# EAGLE design T3DPC_v0.5 (EAGLE 8.5.1)

## Sheet 1 of 4
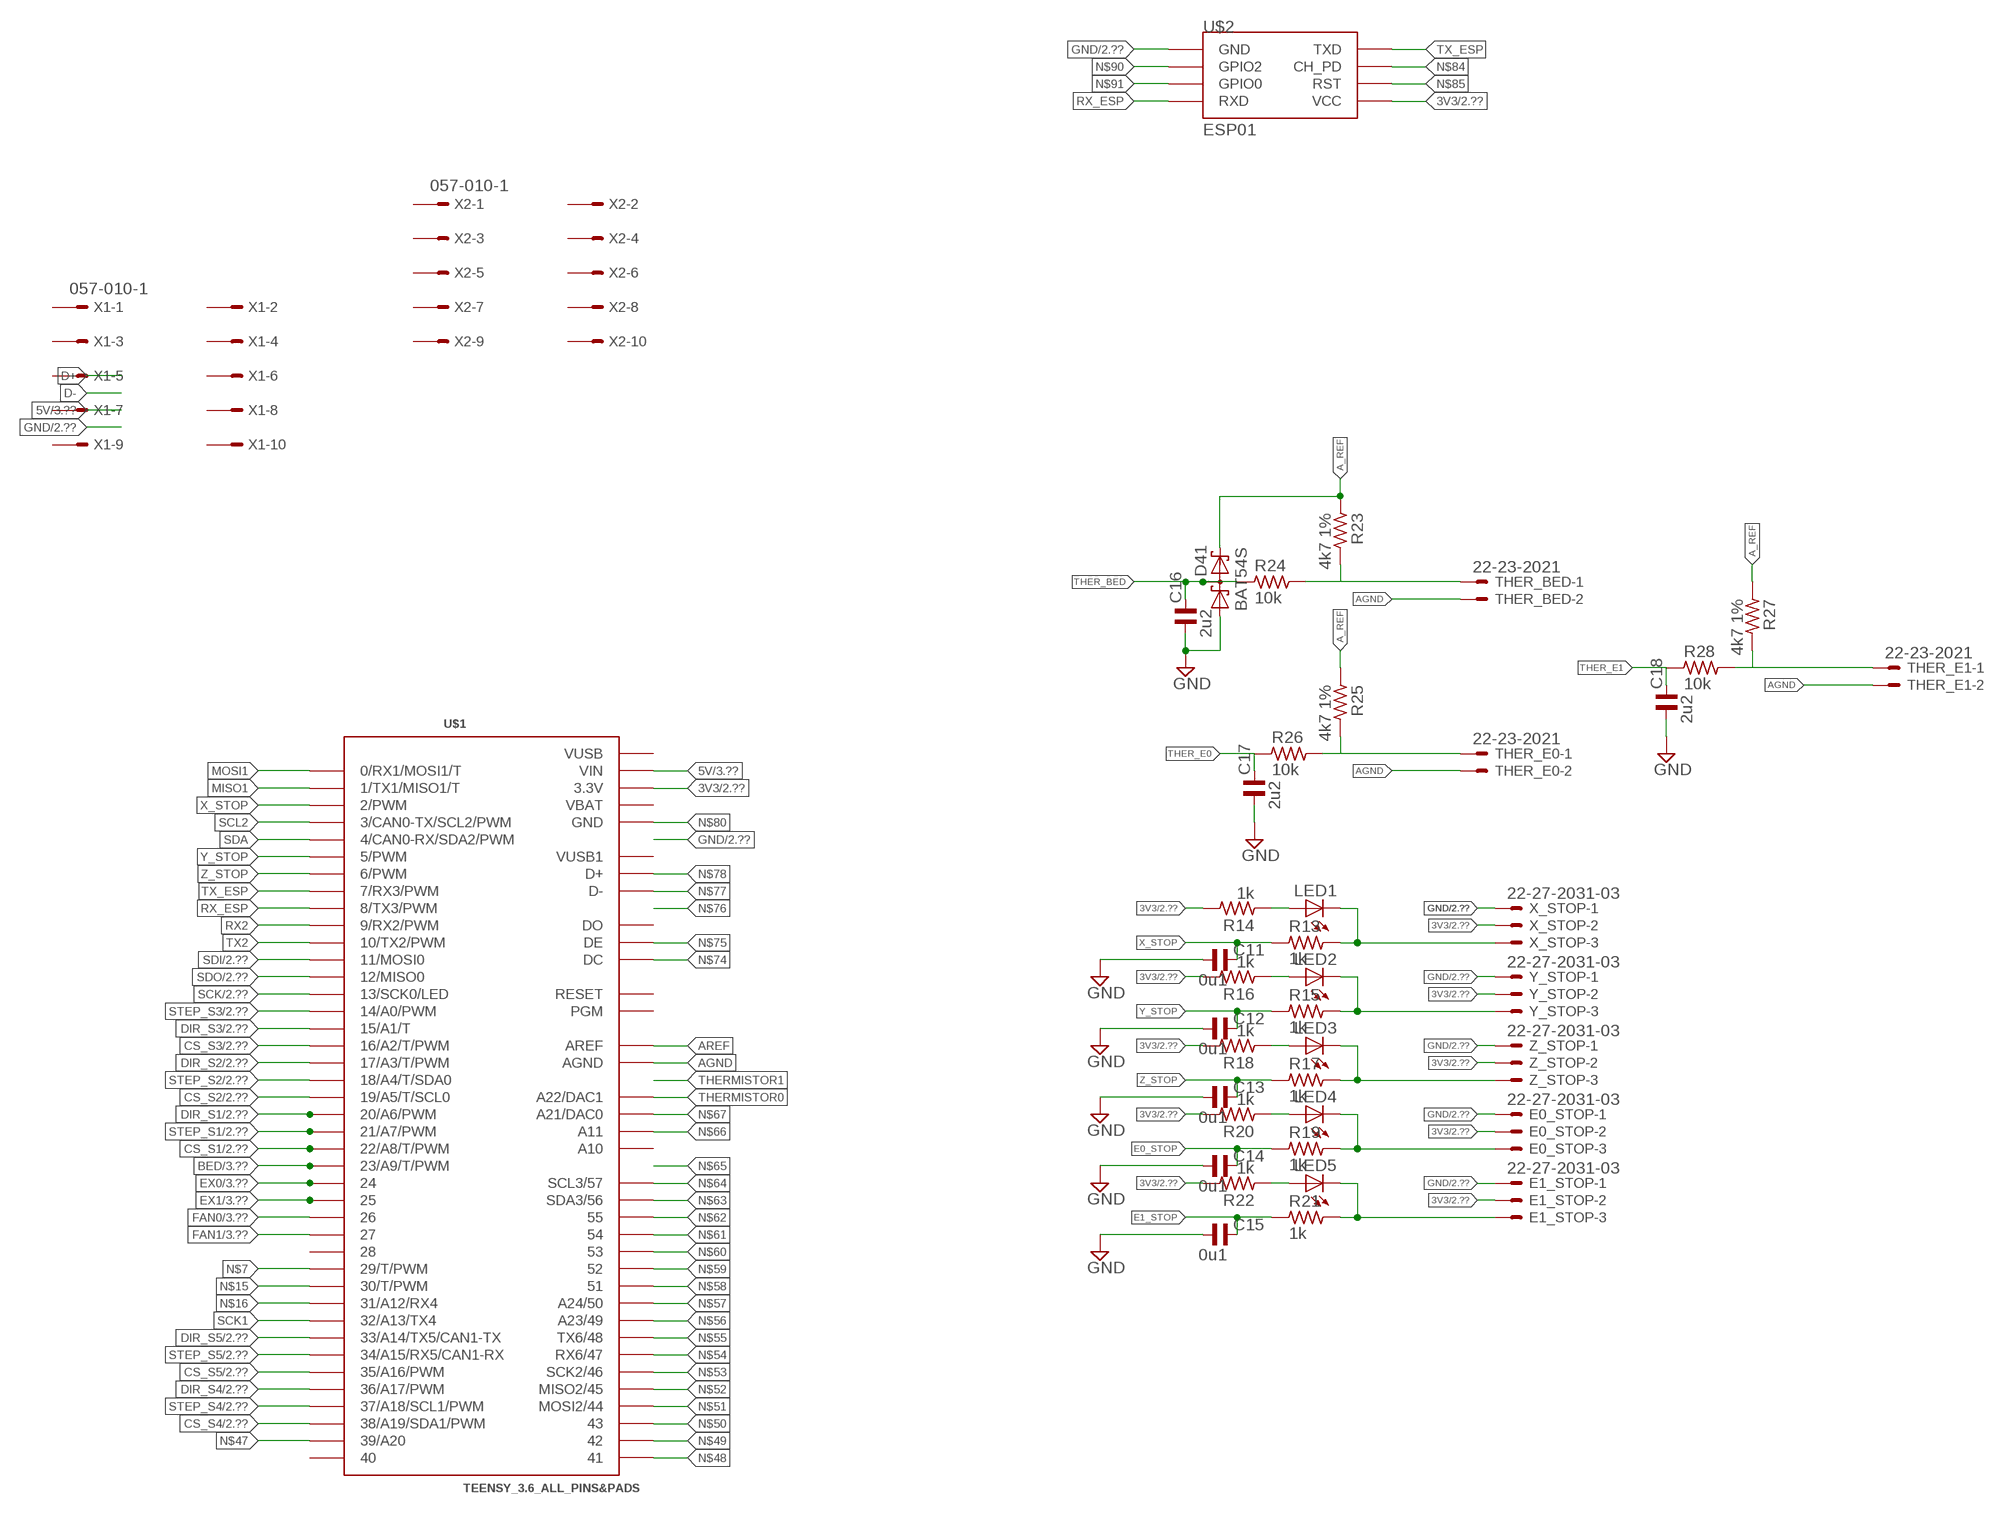
[diagram p0: schematic, sheet 1]

### Parts
C11  0u1  C_0805  [C0805]
C12  0u1  C_0805  [C0805]
C13  0u1  C_0805  [C0805]
C14  0u1  C_0805  [C0805]
C15  0u1  C_0805  [C0805]
C16  2u2  C_0805  [C0805]
C17  2u2  C_0805  [C0805]
C18  2u2  C_0805  [C0805]
D41  BAT54S  [SOT23]
E0_STOP  22-27-2031-03  [6410-03]
E1_STOP  22-27-2031-03  [6410-03]
LED1  LEDCHIPLED_1206  [CHIPLED_1206]
LED2  LEDCHIPLED_1206  [CHIPLED_1206]
LED3  LEDCHIPLED_1206  [CHIPLED_1206]
LED4  LEDCHIPLED_1206  [CHIPLED_1206]
LED5  LEDCHIPLED_1206  [CHIPLED_1206]
R13  1k  R_0805  [R0805]
R14  1k  R_0805  [R0805]
R15  1k  R_0805  [R0805]
R16  1k  R_0805  [R0805]
R17  1k  R_0805  [R0805]
R18  1k  R_0805  [R0805]
R19  1k  R_0805  [R0805]
R20  1k  R_0805  [R0805]
R21  1k  R_0805  [R0805]
R22  1k  R_0805  [R0805]
R23  4k7 1%  R_0805  [R0805]
R24  10k  R_0805  [R0805]
R25  4k7 1%  R_0805  [R0805]
R26  10k  R_0805  [R0805]
R27  4k7 1%  R_0805  [R0805]
R28  10k  R_0805  [R0805]
THER_BED  22-23-2021  [22-23-2021]
THER_E0  22-23-2021  [22-23-2021]
THER_E1  22-23-2021  [22-23-2021]
U$1  TEENSY_3.6_ALL_PINS&PADS  [TEENSY_3.6_ALL_PINS&PADS]
U$2  ESP01  [ESP01]
X1  057-010-1  [057-010-1]
X2  057-010-1  [057-010-1]
X_STOP  22-27-2031-03  [6410-03]
Y_STOP  22-27-2031-03  [6410-03]
Z_STOP  22-27-2031-03  [6410-03]

### Nets
3V3: E0_STOP.2 E1_STOP.2 R14.2 R16.2 R18.2 R20.2 R22.2 U$1.3.3V U$1.3.3V2(3.3V) U$1.3.3V3(3.3V) U$1.3.3V4(3.3V) U$2.VCC X_STOP.2 Y_STOP.2 Z_STOP.2 ; also sheet 2,3
5V: U$1.VIN ; also sheet 3,4
A_REF: D41.2(C2) R23.1 R25.1 R27.1
AGND: C16.1 C17.1 C18.1 D41.1(A1) THER_BED.2 THER_E0.2 THER_E1.2 U$1.AGND ; supply symbol labelled GND
AREF: U$1.AREF
BED: U$1.23/A9(23/A9/T/PWM) ; also sheet 3
CS_S1: U$1.22/A8(22/A8/T/PWM) ; also sheet 2
CS_S2: U$1.19/A5(19/A5/T/SCL0) ; also sheet 2
CS_S3: U$1.16/A2(16/A2/T/PWM) ; also sheet 2
CS_S4: U$1.38/A19(38/A19/SDA1/PWM) ; also sheet 2
CS_S5: U$1.35/A16(35/A16/PWM) ; also sheet 2
DIR_S1: U$1.20/A6(20/A6/PWM) ; also sheet 2
DIR_S2: U$1.17/A3(17/A3/T/PWM) ; also sheet 2
DIR_S3: U$1.15/A1(15/A1/T) ; also sheet 2
DIR_S4: U$1.36/A17(36/A17/PWM) ; also sheet 2
DIR_S5: U$1.33/A14(33/A14/TX5/CAN1-TX) ; also sheet 2
E0_STOP: C14.2 R19.1
E0_STOP_PORT: E0_STOP.3 LED4.C R19.2
E1_STOP: C15.2 R21.1
E1_STOP_PORT: E1_STOP.3 LED5.C R21.2
EX0: U$1.24 ; also sheet 3
EX1: U$1.25 ; also sheet 3
GND: C11.1 C12.1 C13.1 C14.1 C15.1 E0_STOP.1 E1_STOP.1 U$2.GND X_STOP.1 Y_STOP.1 Z_STOP.1 ; also sheet 2,3,4
MISO1: U$1.1(1/TX1/MISO1/T)
MOSI1: U$1.0(0/RX1/MOSI1/T)
N$7: U$1.29(29/T/PWM)
N$10: LED1.A R14.1
N$13: LED2.A R16.1
N$14: LED3.A R18.1
N$15: U$1.30(30/T/PWM)
N$16: U$1.31/A12(31/A12/RX4)
N$17: LED4.A R20.1
N$18: LED5.A R22.1
N$19: R25.2 R26.2 THER_E0.1
N$20: R23.2 R24.2 THER_BED.1
N$22: R27.2 R28.2 THER_E1.1
N$47: U$1.39/A20
N$48: U$1.41
N$49: U$1.42
N$50: U$1.43
N$51: U$1.44(MOSI2/44)
N$52: U$1.45(MISO2/45)
N$53: U$1.46(SCK2/46)
N$54: U$1.47(RX6/47)
N$55: U$1.48(TX6/48)
N$56: U$1.49(A23/49)
N$57: U$1.50(A24/50)
N$58: U$1.51
N$59: U$1.52
N$60: U$1.53
N$61: U$1.54
N$62: U$1.55
N$63: U$1.56(SDA3/56)
N$64: U$1.57(SCL3/57)
N$66: U$1.A11
N$67: U$1.A21(A21/DAC0)
N$74: U$1.DC
N$75: U$1.DE
N$77: U$1.D-
N$78: U$1.D+
N$80: U$1.GND U$1.GND1(GND) U$1.GND2(GND) U$1.GND3(GND) U$1.GND4(GND) U$1.GND5(GND) U$1.GND6(GND)
N$84: U$2.CH_PD
N$85: U$2.RST
N$90: U$2.GPIO2
N$91: U$2.GPIO0
RX2: U$1.9(9/RX2/PWM)
RX_ESP: U$1.8(8/TX3/PWM) U$2.RX(RXD)
SCK: U$1.13(13/SCK0/LED) ; also sheet 2
SCK1: U$1.32/A13(32/A13/TX4)
SCL2: U$1.3(3/CAN0-TX/SCL2/PWM)
SDA: U$1.4(4/CAN0-RX/SDA2/PWM)
SDI: U$1.11(11/MOSI0) ; also sheet 2
SDO: U$1.12(12/MISO0) ; also sheet 2
STEP_S1: U$1.21/A7(21/A7/PWM) ; also sheet 2
STEP_S2: U$1.18/A4(18/A4/T/SDA0) ; also sheet 2
STEP_S3: U$1.14/A0(14/A0/PWM) ; also sheet 2
STEP_S4: U$1.37/A18(37/A18/SCL1/PWM) ; also sheet 2
STEP_S5: U$1.34/A15(34/A15/RX5/CAN1-RX) ; also sheet 2
THER_BED: C16.2 D41.3(C1A2) R24.1
THER_E0: C17.2 R26.1
THER_E1: C18.2 R28.1
THERMISTOR0: U$1.A22(A22/DAC1)
TX2: U$1.10(10/TX2/PWM)
TX_ESP: U$1.7(7/RX3/PWM) U$2.TX(TXD)
X_STOP: C11.2 R13.1 U$1.2(2/PWM)
X_STOP_PORT: LED1.C R13.2 X_STOP.3
Y_STOP: C12.2 R15.1 U$1.5(5/PWM)
Y_STOP_PORT: LED2.C R15.2 Y_STOP.3
Z_STOP: C13.2 R17.1 U$1.6(6/PWM)
Z_STOP_PORT: LED3.C R17.2 Z_STOP.3
Unconnected: U$1.26 U$1.27 U$1.28 U$1.40 U$1.A10 U$1.DO U$1.PGM U$1.RESET X1.1 X1.2 X1.3 X1.4 X1.5 X1.6 X1.7 X1.8 X1.9 X1.10 X2.1 X2.2 X2.3 X2.4 X2.5 X2.6 X2.7 X2.8 X2.9 X2.10

## Sheet 2 of 4
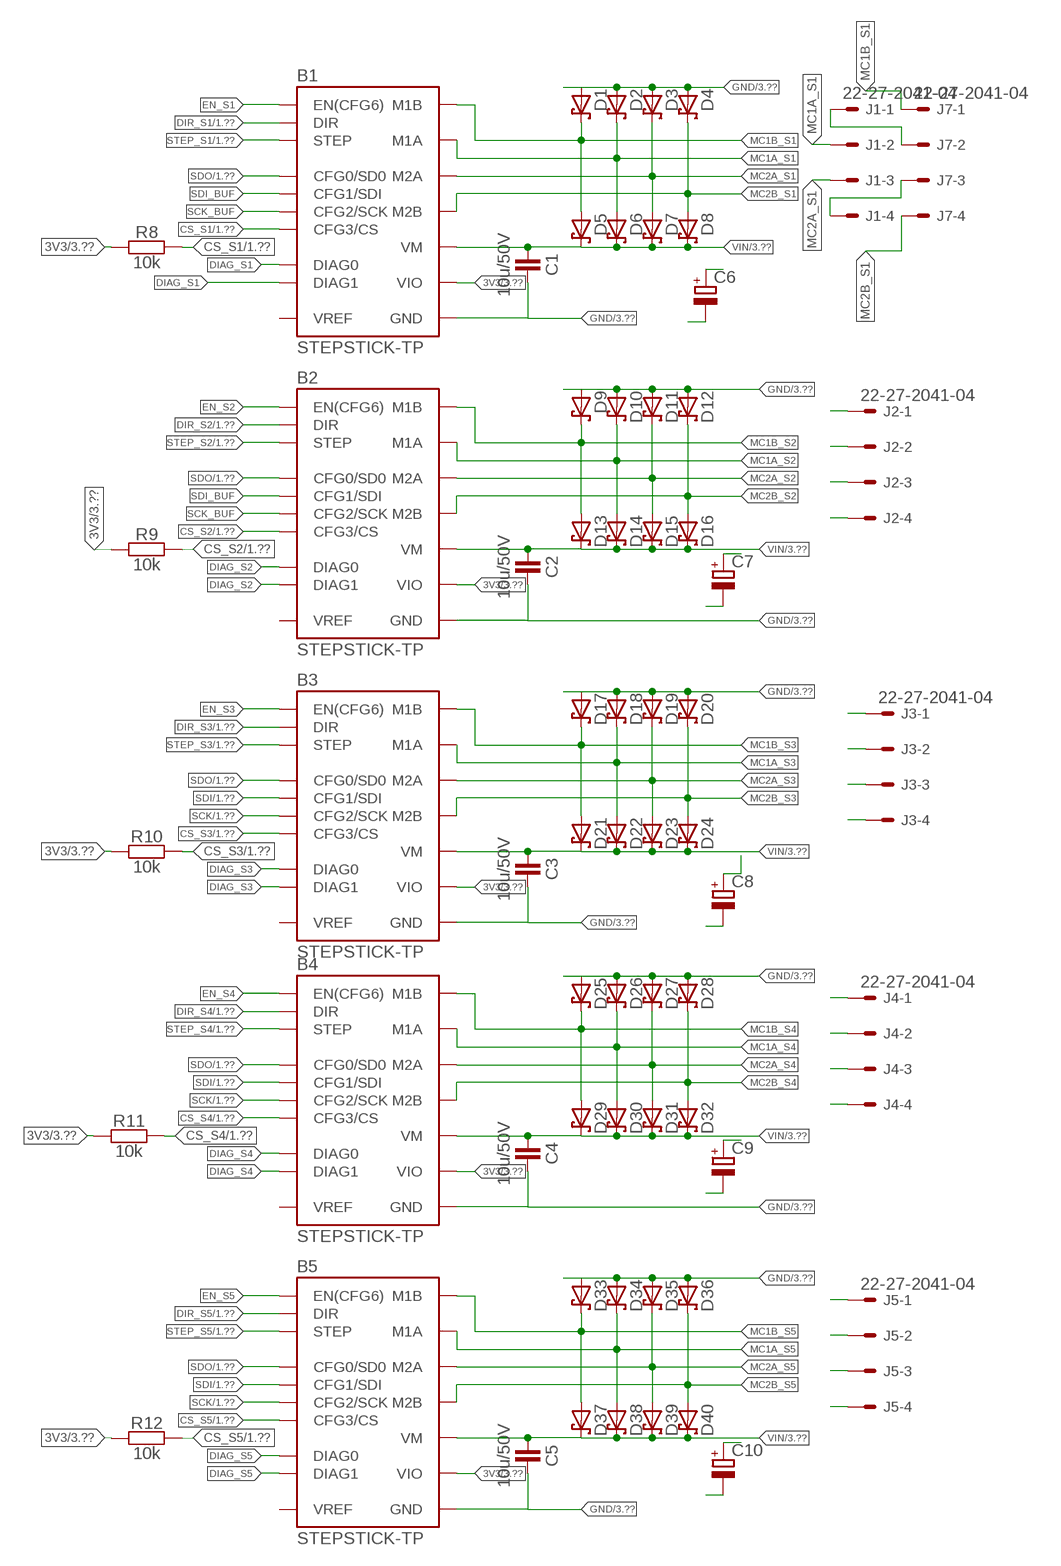
[diagram p1: schematic, sheet 2]

### Parts
B1  STEPSTICK-TP  [STEPSTICK_TP]
B2  STEPSTICK-TP  [STEPSTICK_TP]
B3  STEPSTICK-TP  [STEPSTICK_TP]
B4  STEPSTICK-TP  [STEPSTICK_TP]
B5  STEPSTICK-TP  [STEPSTICK_TP]
C1  10u/50V  CAPACITOR-1210  [C1210]
C2  10u/50V  CAPACITOR-1210  [C1210]
C3  10u/50V  CAPACITOR-1210  [C1210]
C4  10u/50V  CAPACITOR-1210  [C1210]
C5  10u/50V  CAPACITOR-1210  [C1210]
C6  CPOL-EU153CLV-0505  [153CLV-0505]
C7  CPOL-EU153CLV-0505  [153CLV-0505]
C8  CPOL-EU153CLV-0505  [153CLV-0505]
C9  CPOL-EU153CLV-0505  [153CLV-0505]
C10  CPOL-EU153CLV-0505  [153CLV-0505]
D1  D_SCHOTTKY-SMA  [SMA_DO214AC]
D2  D_SCHOTTKY-SMA  [SMA_DO214AC]
D3  D_SCHOTTKY-SMA  [SMA_DO214AC]
D4  D_SCHOTTKY-SMA  [SMA_DO214AC]
D5  D_SCHOTTKY-SMA  [SMA_DO214AC]
D6  D_SCHOTTKY-SMA  [SMA_DO214AC]
D7  D_SCHOTTKY-SMA  [SMA_DO214AC]
D8  D_SCHOTTKY-SMA  [SMA_DO214AC]
D9  D_SCHOTTKY-SMA  [SMA_DO214AC]
D10  D_SCHOTTKY-SMA  [SMA_DO214AC]
D11  D_SCHOTTKY-SMA  [SMA_DO214AC]
D12  D_SCHOTTKY-SMA  [SMA_DO214AC]
D13  D_SCHOTTKY-SMA  [SMA_DO214AC]
D14  D_SCHOTTKY-SMA  [SMA_DO214AC]
D15  D_SCHOTTKY-SMA  [SMA_DO214AC]
D16  D_SCHOTTKY-SMA  [SMA_DO214AC]
D17  D_SCHOTTKY-SMA  [SMA_DO214AC]
D18  D_SCHOTTKY-SMA  [SMA_DO214AC]
D19  D_SCHOTTKY-SMA  [SMA_DO214AC]
D20  D_SCHOTTKY-SMA  [SMA_DO214AC]
D21  D_SCHOTTKY-SMA  [SMA_DO214AC]
D22  D_SCHOTTKY-SMA  [SMA_DO214AC]
D23  D_SCHOTTKY-SMA  [SMA_DO214AC]
D24  D_SCHOTTKY-SMA  [SMA_DO214AC]
D25  D_SCHOTTKY-SMA  [SMA_DO214AC]
D26  D_SCHOTTKY-SMA  [SMA_DO214AC]
D27  D_SCHOTTKY-SMA  [SMA_DO214AC]
D28  D_SCHOTTKY-SMA  [SMA_DO214AC]
D29  D_SCHOTTKY-SMA  [SMA_DO214AC]
D30  D_SCHOTTKY-SMA  [SMA_DO214AC]
D31  D_SCHOTTKY-SMA  [SMA_DO214AC]
D32  D_SCHOTTKY-SMA  [SMA_DO214AC]
D33  D_SCHOTTKY-SMA  [SMA_DO214AC]
D34  D_SCHOTTKY-SMA  [SMA_DO214AC]
D35  D_SCHOTTKY-SMA  [SMA_DO214AC]
D36  D_SCHOTTKY-SMA  [SMA_DO214AC]
D37  D_SCHOTTKY-SMA  [SMA_DO214AC]
D38  D_SCHOTTKY-SMA  [SMA_DO214AC]
D39  D_SCHOTTKY-SMA  [SMA_DO214AC]
D40  D_SCHOTTKY-SMA  [SMA_DO214AC]
J1  22-27-2041-04  [6410-04]
J2  22-27-2041-04  [6410-04]
J3  22-27-2041-04  [6410-04]
J4  22-27-2041-04  [6410-04]
J5  22-27-2041-04  [6410-04]
J7  22-27-2041-04  [6410-04]
R8  10k  RESISTOR-0805  [C0805]
R9  10k  RESISTOR-0805  [C0805]
R10  10k  RESISTOR-0805  [C0805]
R11  10k  RESISTOR-0805  [C0805]
R12  10k  RESISTOR-0805  [C0805]

### Nets
3V3: B1.VIO B2.VIO B3.VIO B4.VIO B5.VIO R8.1 R9.1 R10.1 R11.1 R12.1 ; also sheet 1,3
CS_S1: B1.CFG3(CFG3/CS) R8.2 ; also sheet 1
CS_S2: B2.CFG3(CFG3/CS) R9.2 ; also sheet 1
CS_S3: B3.CFG3(CFG3/CS) R10.2 ; also sheet 1
CS_S4: B4.CFG3(CFG3/CS) R11.2 ; also sheet 1
CS_S5: B5.CFG3(CFG3/CS) R12.2 ; also sheet 1
DIAG_S1: B1.DIAG0 B1.DIAG1
DIAG_S2: B2.DIAG0 B2.DIAG1
DIAG_S3: B3.DIAG0 B3.DIAG1
DIAG_S4: B4.DIAG0 B4.DIAG1
DIAG_S5: B5.DIAG0 B5.DIAG1
DIR_S1: B1.DIR ; also sheet 1
DIR_S2: B2.DIR ; also sheet 1
DIR_S3: B3.DIR ; also sheet 1
DIR_S4: B4.DIR ; also sheet 1
DIR_S5: B5.DIR ; also sheet 1
EN_S1: B1.EN(EN(CFG6))
EN_S2: B2.EN(EN(CFG6))
EN_S3: B3.EN(EN(CFG6))
EN_S4: B4.EN(EN(CFG6))
EN_S5: B5.EN(EN(CFG6))
GND: B1.GND@1(GND) B1.GND@2(GND) B2.GND@1(GND) B2.GND@2(GND) B3.GND@1(GND) B3.GND@2(GND) B4.GND@1(GND) B4.GND@2(GND) B5.GND@1(GND) B5.GND@2(GND) C1.2 C2.2 C3.2 C4.2 C5.2 C6.- C7.- C8.- C9.- C10.- D1.A D2.A D3.A D4.A D9.A D10.A D11.A D12.A D17.A D18.A D19.A D20.A D25.A D26.A D27.A D28.A D33.A D34.A D35.A D36.A ; also sheet 1,3,4
MC1A_S1: B1.M1A D2.C D6.A J1.2
MC1A_S2: B2.M1A D10.C D14.A J2.2
MC1A_S3: B3.M1A D18.C D22.A J3.2
MC1A_S4: B4.M1A D26.C D30.A J4.2
MC1A_S5: B5.M1A D34.C D38.A J5.2
MC1B_S1: B1.M1B D1.C D5.A J7.1
MC1B_S2: B2.M1B D9.C D13.A J2.1
MC1B_S3: B3.M1B D17.C D21.A J3.1
MC1B_S4: B4.M1B D25.C D29.A J4.1
MC1B_S5: B5.M1B D33.C D37.A J5.1
MC2A_S1: B1.M2A D3.C D7.A J1.3
MC2A_S2: B2.M2A D11.C D15.A J2.3
MC2A_S3: B3.M2A D19.C D23.A J3.3
MC2A_S4: B4.M2A D27.C D31.A J4.3
MC2A_S5: B5.M2A D35.C D39.A J5.3
MC2B_S1: B1.M2B D4.C D8.A J7.4
MC2B_S2: B2.M2B D12.C D16.A J2.4
MC2B_S3: B3.M2B D20.C D24.A J3.4
MC2B_S4: B4.M2B D28.C D32.A J4.4
MC2B_S5: B5.M2B D36.C D40.A J5.4
N$11: J1.4 J7.3
N$12: J1.1 J7.2
SCK: B3.CFG2(CFG2/SCK) B4.CFG2(CFG2/SCK) B5.CFG2(CFG2/SCK) ; also sheet 1
SCK_BUF: B1.CFG2(CFG2/SCK) B2.CFG2(CFG2/SCK)
SDI: B3.CFG1(CFG1/SDI) B4.CFG1(CFG1/SDI) B5.CFG1(CFG1/SDI) ; also sheet 1
SDI_BUF: B1.CFG1(CFG1/SDI) B2.CFG1(CFG1/SDI)
SDO: B1.NC/CFG0(CFG0/SD0) B2.NC/CFG0(CFG0/SD0) B3.NC/CFG0(CFG0/SD0) B4.NC/CFG0(CFG0/SD0) B5.NC/CFG0(CFG0/SD0) ; also sheet 1
STEP_S1: B1.STEP ; also sheet 1
STEP_S2: B2.STEP ; also sheet 1
STEP_S3: B3.STEP ; also sheet 1
STEP_S4: B4.STEP ; also sheet 1
STEP_S5: B5.STEP ; also sheet 1
VIN: B1.VM B2.VM B3.VM B4.VM B5.VM C1.1 C2.1 C3.1 C4.1 C5.1 C6.+ C7.+ C8.+ C9.+ C10.+ D5.C D6.C D7.C D8.C D13.C D14.C D15.C D16.C D21.C D22.C D23.C D24.C D29.C D30.C D31.C D32.C D37.C D38.C D39.C D40.C ; also sheet 3,4
Unconnected: B1.VREF B2.VREF B3.VREF B4.VREF B5.VREF

## Sheet 3 of 4
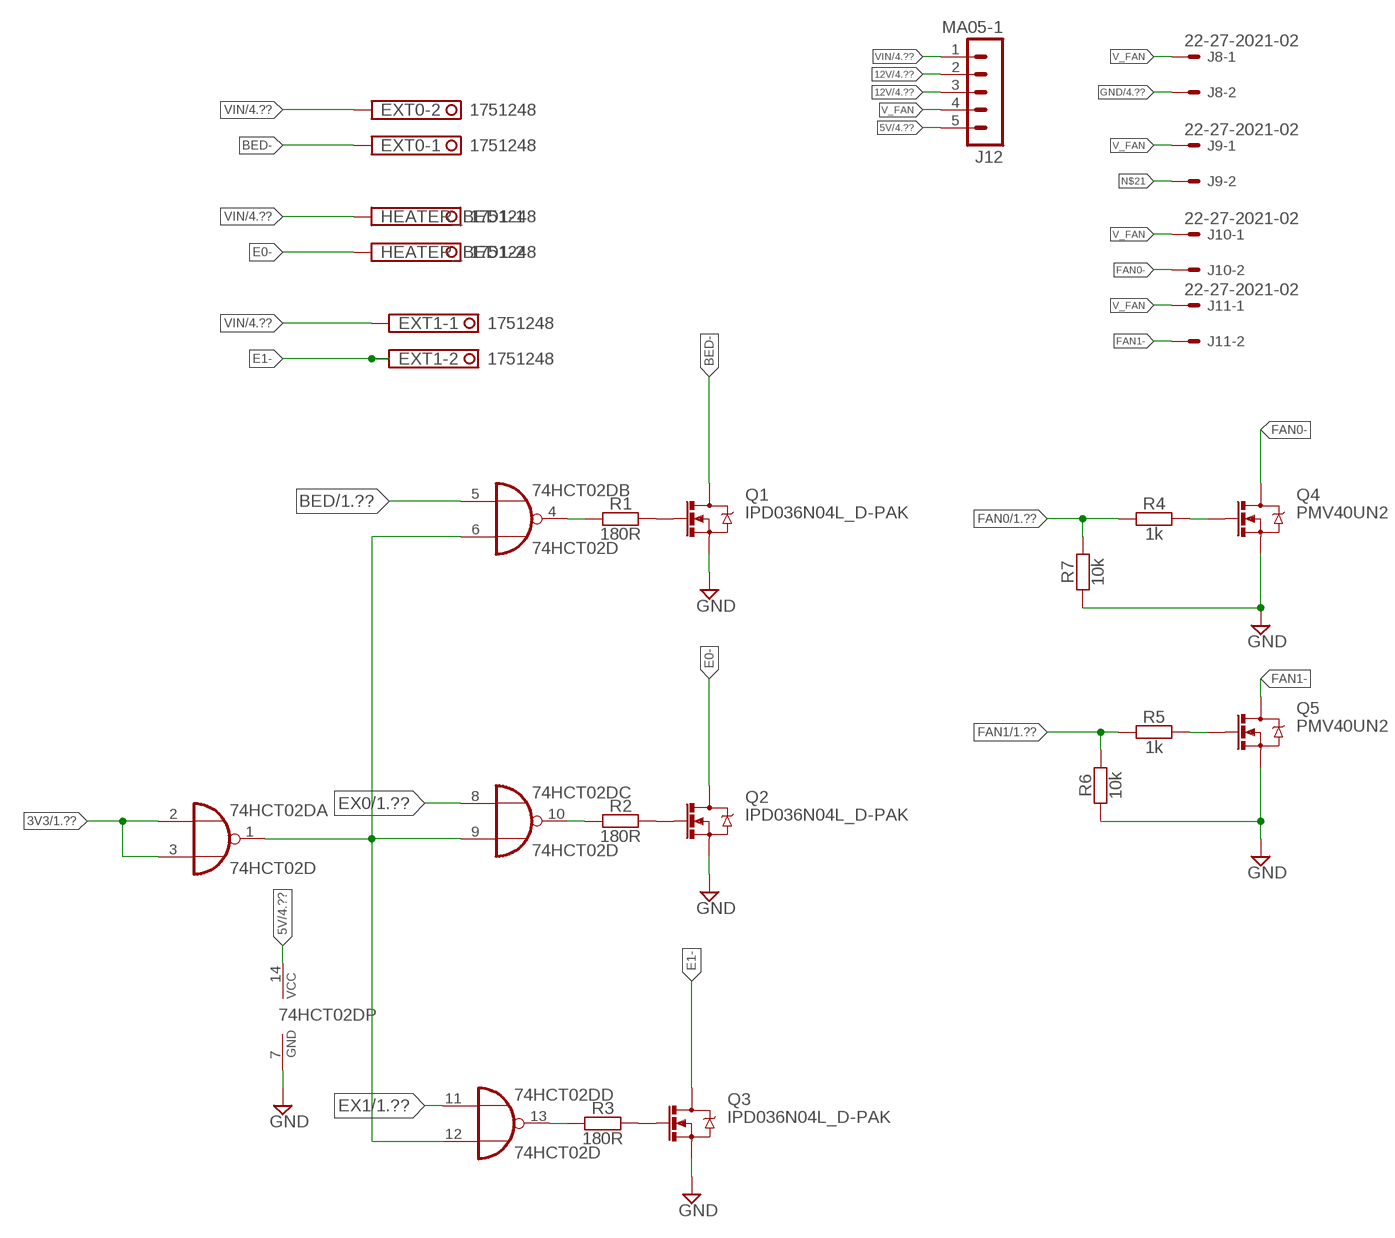
[diagram p2: schematic, sheet 3]

### Parts
74HCT02D  74HCT02D  [SO14]
EXT0  1751248  [1751248]
EXT1  1751248  [1751248]
HEATER_BED1  1751248  [1751248]
J8  22-27-2021-02  [6410-02]
J9  22-27-2021-02  [6410-02]
J10  22-27-2021-02  [6410-02]
J11  22-27-2021-02  [6410-02]
J12  MA05-1  [MA05-1]
Q1  IPD036N04L_D-PAK  [D-PAK_TO252AA]
Q2  IPD036N04L_D-PAK  [D-PAK_TO252AA]
Q3  IPD036N04L_D-PAK  [D-PAK_TO252AA]
Q4  PMV40UN2  [SOT23-3]
Q5  PMV40UN2  [SOT23-3]
R1  180R  RESISTOR-0805  [C0805]
R2  180R  RESISTOR-0805  [C0805]
R3  180R  RESISTOR-0805  [C0805]
R4  1k  RESISTOR-0805  [C0805]
R5  1k  RESISTOR-0805  [C0805]
R6  10k  RESISTOR-0805  [C0805]
R7  10k  RESISTOR-0805  [C0805]

### Nets
3V3: 74HCT02D.2(A:I0) 74HCT02D.3(A:I1) ; also sheet 1,2
5V: 74HCT02D.14(P:VCC) J12.5 ; also sheet 1,4
12V: J12.2 J12.3 ; also sheet 4
BED: 74HCT02D.5(B:I0) ; also sheet 1
BED-: EXT0.1 Q1.2(D)
E0-: HEATER_BED1.2 Q2.2(D)
E1-: EXT1.2 Q3.2(D)
EX0: 74HCT02D.8(C:I0) ; also sheet 1
EX1: 74HCT02D.11(D:I0) ; also sheet 1
FAN0: R4.1 R7.2 ; also sheet 1
FAN0-: J10.2 Q4.3(D)
FAN1: R5.1 R6.2 ; also sheet 1
FAN1-: J11.2 Q5.3(D)
GND: 74HCT02D.7(P:GND) J8.2 Q1.3(S) Q2.3(S) Q3.3(S) Q4.2(S) Q5.2(S) R6.1 R7.1 ; also sheet 1,2,4
N$1: Q1.1(G) R1.2
N$2: Q2.1(G) R2.2
N$3: Q3.1(G) R3.2
N$4: 74HCT02D.4(B:O) R1.1
N$5: 74HCT02D.10(C:O) R2.1
N$6: 74HCT02D.13(D:O) R3.1
N$8: 74HCT02D.1(A:O) 74HCT02D.6(B:I1) 74HCT02D.9(C:I1) 74HCT02D.12(D:I1)
N$9: Q4.1(G) R4.2
N$21: J9.2
N$89: Q5.1(G) R5.2
V_FAN: J8.1 J9.1 J10.1 J11.1 J12.4
VIN: EXT0.2 EXT1.1 HEATER_BED1.1 J12.1 ; also sheet 2,4

## Sheet 4 of 4: Power
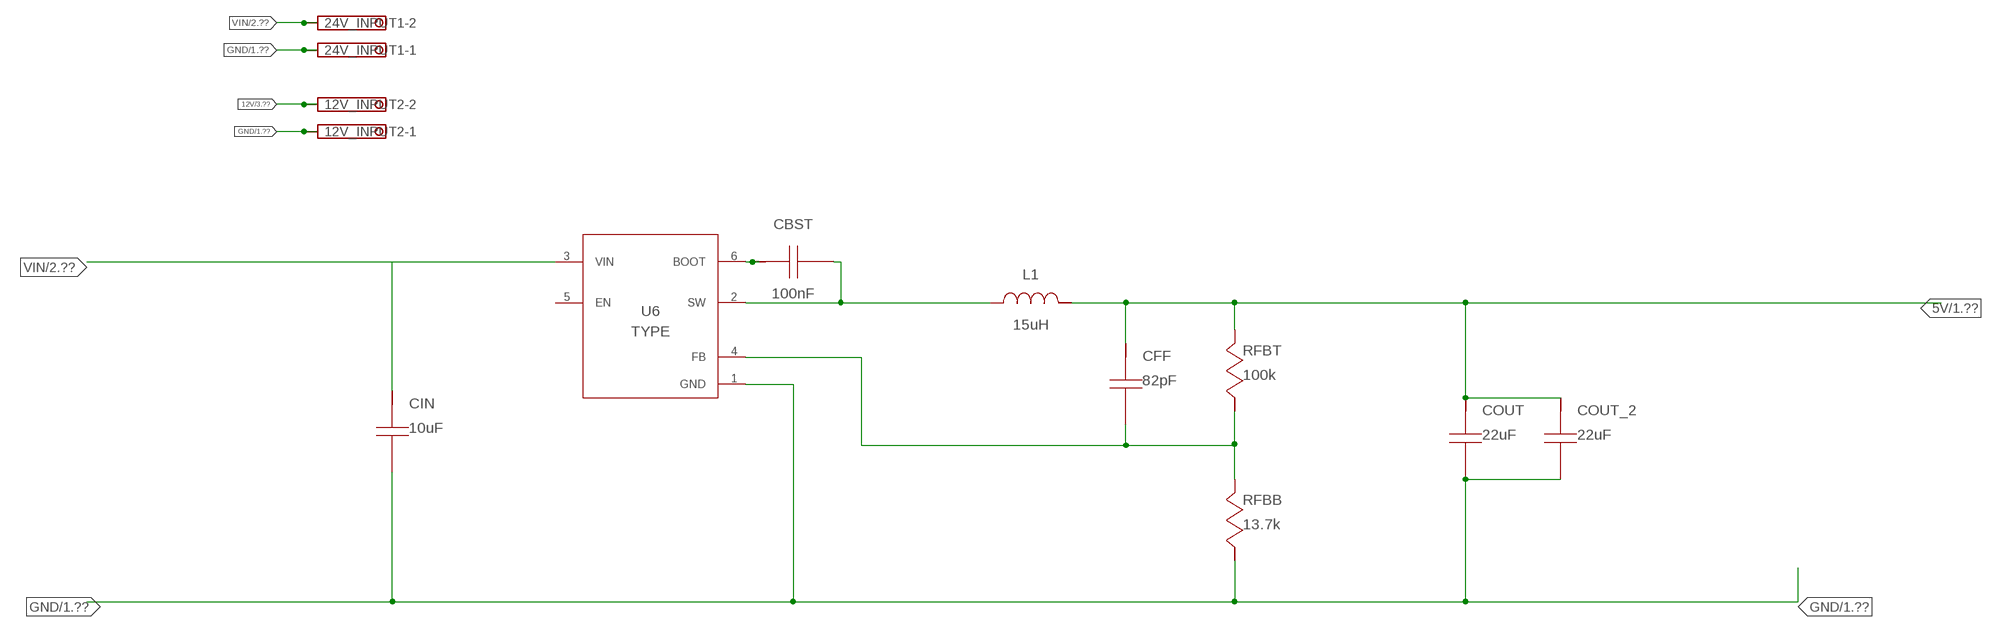
[diagram p3: schematic, sheet 4]

### Parts
12V_INPUT2  1751248  [1751248]
24V_INPUT1  1751248  [1751248]
CBST  100nF  C0805C104K5RACTU  [0805]
CFF  82pF  CC0805JRNPO9BN820  [0805]
CIN  10uF  C3216X5R1H106K160AB  [1206_180]
COUT  22uF  C4532X5R1E226M  [1812]
COUT_2  22uF  C4532X5R1E226M  [1812]
L1  15uH  VLP8040T-150M  [VLP8040]
RFBB  13.7k  ERJ-6ENF1372V  [0805]
RFBT  100k  ERJ-6ENF1003V  [0805]
U6  Value  TPS54202DDCR  [DDC0006A_N]

### Nets
1: CBST.1 U6.6(BOOT)
2: CFF.2 RFBB.1 RFBT.2 U6.4(FB)
3: CBST.2 L1.1 U6.2(SW)
5V: CFF.1 COUT.1 COUT_2.1 L1.2 RFBT.1 ; also sheet 1,3
12V: 12V_INPUT2.2 ; also sheet 3
GND: 12V_INPUT2.1 24V_INPUT1.1 CIN.2 COUT.2 COUT_2.2 RFBB.2 U6.1(GND) ; also sheet 1,2,3
N$23: CIN.1
VIN: 24V_INPUT1.2 U6.3(VIN) ; also sheet 2,3
Unconnected: U6.5(EN)

## Power pins joined to a net without a drawn wire
VBAT: U$1.VBAT
VUSB: U$1.VUSB
VUSB1: U$1.VUSB1

## Library data of the parts
12V_INPUT2 24V_INPUT1 EXT0 EXT1 HEATER_BED1 = con-phoenix-350:1751248: MKDS 1/ 2-3,5 Printklemme Nennstrom: 10 A Bemessungsspannung: 160 V Raster: 3,5 mm Polzahl: 2 Montageart: Löten Anschlussart: Schraubanschluss Anschlussrichtung vom Leiter zur Platine: 0° Source: http://eshop.phoenixcontact.com .. 1751248.pdf; OC_FARNELL: unknown; OC_NEWARK: unknown
74HCT02D = 74xx-eu:74*02: Quad 2-input NOR gate
B1-B5 = we-board:STEPSTICK: SilentStepStick - Trinamic TMC2100/TMC2130 Stepper Motor Driver TMC2100 - CFG pins for configuration TMC2130 - SPI for configuration Pin CFG0/SDO only available on TMC2130 SilentStepStick.
C1-C5 = we-rcl:CAPACITOR: Capacitors ...2.2uF @ 6.3V -> 0402 ...4.7uF @ 6.3V -> 0603 ...10uF @ 16V -> 0805 ...22uF @ 25V -> 1206
C6-C10 = rcl:CPOL-EU: POLARIZED CAPACITOR, European symbol
C11-C18 = rc-master-smd:C_: NON-POLARIZED CAP
CBST = AcceleratedDesigns_Lib:C0805C104K5RACTU; CAP: 1.0E7; ESR: 0.064; IRMS: 1.64; MANUFACTURER_NAME: Kemet; MANUFACTURER_PART_NUMBER: C0805C104K5RACTU; VDC: 50.0; VENDOR: Kemet
CFF = AcceleratedDesigns_Lib:CC0805JRNPO9BN820; CAP: 8.2E11; DATASHEETURL: httpwww.yageo.comdocumentsrecentUPY%2DGP%5FNP0%5F16V%2Dto%2D50V%5F10.pdf; ESR: 0.0; IRMS: 0.0; MANUFACTURER_NAME: Yageo America; MANUFACTURER_PART_NUMBER: CC0805JRNPO9BN820; VDC: 50.0; VENDOR: Yageo America
CIN = AcceleratedDesigns_Lib:C3216X5R1H106K160AB; CAP: 1.0E5; DATASHEETURL: httpsproduct.tdk.comensearchcapacitorceramicmlccinfo?part%5Fno%3DC3216X5R1H106K160AB; ESR: 0.002229; IRMS: 4.85932; MANUFACTURER_NAME: TDK; MANUFACTURER_PART_NUMBER: C3216X5R1H106K160AB; VDC: 50.0; VENDOR: TDK
COUT COUT_2 = AcceleratedDesigns_Lib:C4532X5R1E226M; CAP: 2.2E5; DATASHEETURL: httpwww.tdk.co.jptefe02e4855%5Fc.pdf; ESR: 0.002197; IRMS: 0.0; MANUFACTURER_NAME: TDK; MANUFACTURER_PART_NUMBER: C4532X5R1E226M; VDC: 25.0; VENDOR: TDK
D1-D40 = we-rcl:D_SCHOTTKY: Schottky Diodes
D41 = diode:BAT54S: Schottky Diodes Pin connection corrected 2011-05-04 Source: Fairchild .. BAT54.pdf
E0_STOP E1_STOP X_STOP Y_STOP Z_STOP = con-molex:22-?-03: CONNECTOR wire to board 2.54 mm (.1 inch) pitch header; OC_FARNELL: unknown; OC_NEWARK: unknown
J1-J5 J7 = con-molex:22-?-04: CONNECTOR wire to board 2.54 mm (.1 inch) pitch header; OC_FARNELL: unknown; OC_NEWARK: unknown
J8-J11 = con-molex:22-?-02: CONNECTOR wire to board 2.54 mm (.1 inch) pitch header; OC_FARNELL: unknown; OC_NEWARK: unknown
J12 = we-con:MA05-1: Pin Header
L1 = AcceleratedDesigns_Lib:VLP8040T-150M; DATASHEETURL: httpwww.tdk.co.jptjfx01j531_vlp.pdf; DCR: 0.058; DESCRIPTION: Unknown; IDC: 2.6; L: 1.5E5; MANUFACTURER: TDK; MANUFACTURER_NAME: TDK; MANUFACTURER_PART_NUMBER: VLP8040T150M; PACKAGE_DESIGNATOR: VLP8040; VENDOR: TDK
LED1-LED5 = led:LED: LED OSRAM: - CHIPLED LG R971, LG N971, LY N971, LG Q971, LY Q971, LO R971, LY R971 LH N974, LH R974 LS Q976, LO Q976, LY Q976 LO Q996 - Hyper CHIPLED LW Q18S LB Q993, LB Q99A, LB R99A - SideLED LS A670, LO A670, LY A670, LG A670, LP A670 LB A673, LV A673, LT A673, LW A673 LH A674 LY A675 LS A676, LA A676, LO A676, LY A676, LW A676 LS A679, LY A679, LG A679 - Hyper Micro SIDELED® LS Y876, LA Y876, LO Y876, LY Y876 LT Y87S - SmartLED LW L88C, LW L88S LB L89C, LB L89S, LG L890 LS L89K, LO L89K, LY L89K LS L896, LA L896, LO L896, LY L896 - TOPLED LS T670, LO T670, LY T670, LG T670, LP T670 LSG T670, LSP T670, LSY T670, LOP T670, LYG T670 LG T671, LOG T671, LSG T671 LB T673, LV T673, LT T673, LW T673 LH T674 LS T676, LA T676, LO T676, LY T676, LB T676, LH T676, LSB T676, LW T676 LB T67C, LV T67C, LT T67C, LS T67K, LO T67K, LY T67K, LW E67C LS E67B, LA E67B, LO E67B, LY E67B, LB E67C, LV E67C, LT E67C LW T67C LS T679, LY T679, LG T679 LS T770, LO T770, LY T770, LG T770, LP T770 LB T773, LV T773, LT T773, LW T773 LH T774 LS E675, LA E675, LY E675, LS T675 LS T776, LA T776, LO T776, LY T776, LB T776 LHGB T686 LT T68C, LB T68C - Hyper Mini TOPLED® LB M676 - Mini TOPLED Santana® LG M470 LS M47K, LO M47K, LY M47K Source: http://www.osram.convergy.de LUXEON: - LUMILED® LXK2-PW12-R00, LXK2-PW12-S00, LXK2-PW14-U00, LXK2-PW14-V00 LXK2-PM12-R00, LXK2-PM12-S00, LXK2-PM14-U00 LXK2-PE12-Q00, LXK2-PE12-R00, LXK2-PE12-S00, LXK2-PE14-T00, LXK2-PE14-U00 LXK2-PB12-K00, LXK2-PB12-L00, LXK2-PB12-M00, LXK2-PB14-N00, LXK2-PB14-P00, LXK2-PB14-Q00 LXK2-PR12-L00, LXK2-PR12-M00, LXK2-PR14-Q00, LXK2-PR14-R00 LXK2-PD12-Q00, LXK2-PD12-R00, LXK2-PD12-S00 LXK2-PH12-R00, LXK2-PH12-S00 LXK2-PL12-P00, LXK2-PL12-Q00, LXK2-PL12-R00 Source: www.luxeon.com KINGBRIGHT: KA-3528ASYC Source: www.kingbright.com
Q1-Q3 = infineon:IPD036N04L: Generic N-channel mosfet
Q4 Q5 = nxp:PMV40UN2
R1-R12 = we-rcl:RESISTOR: Resistors all kinds in 0402 and 0603
R13-R28 = rc-master-smd:R_: RESISTOR
RFBB = AcceleratedDesigns_Lib:ERJ-6ENF1372V; MANUFACTURER_NAME: Panasonic; MANUFACTURER_PART_NUMBER: ERJ6ENF1372V; POWER: 0.125; RESISTANCE: 13700.0; TOLERANCE: 1.0; VENDOR: Panasonic
RFBT = AcceleratedDesigns_Lib:ERJ-6ENF1003V; MANUFACTURER_NAME: Panasonic; MANUFACTURER_PART_NUMBER: ERJ6ENF1003V; POWER: 0.125; RESISTANCE: 100000.0; TOLERANCE: 1.0; VENDOR: Panasonic
THER_BED THER_E0 THER_E1 = con-molex:22-23-2021: .100" (2.54mm) Center Header - 2 Pin; MF: MOLEX; MPN: 22-23-2021; OC_FARNELL: 1462926; OC_NEWARK: 25C3832
U6 = AcceleratedDesigns_Lib:TPS54202DDCR; ALTERNATEPARTNUMBER: TPS54202DDCT; APPLICATION_BUILDNUMBER: *; COMPTYPE: IC; MANUFACTURER: Texas Instruments; MANUFACTURER_NAME: Texas Instruments; MANUFACTURER_PART_NUMBER: TPS54202DDCR; MOUNTTYPE: SMT; PACKAGEREFERENCE: DDC0006A; PARTNUMBER: TPS54202DDCR; PIN_COUNT: 6; REFDES: RefDes; ROHS: Y; TYPE: TYPE
U$1 = Teensy_3_and_LC_Series_Boards_v1.4:TEENSY_3.6_ALL_PINS&PADS: All pins and pads on the Teensy 3.6 exposed. Assumes the use of multiple, unshrouded headers to get access to the pads on the underside of the Teensy These headers should be a 2x5, 2x4, and a 2x3 with a 0.1" hole spacing / pitch.
U$2 = esp8266modules:ESP01: ESP8266 Wifi module 01
X1 X2 = con-panduit:057-010-: CONNECTOR 10-pin series 057 contact pc board low profile headers; OC_FARNELL: unknown; OC_NEWARK: unknown

## Board
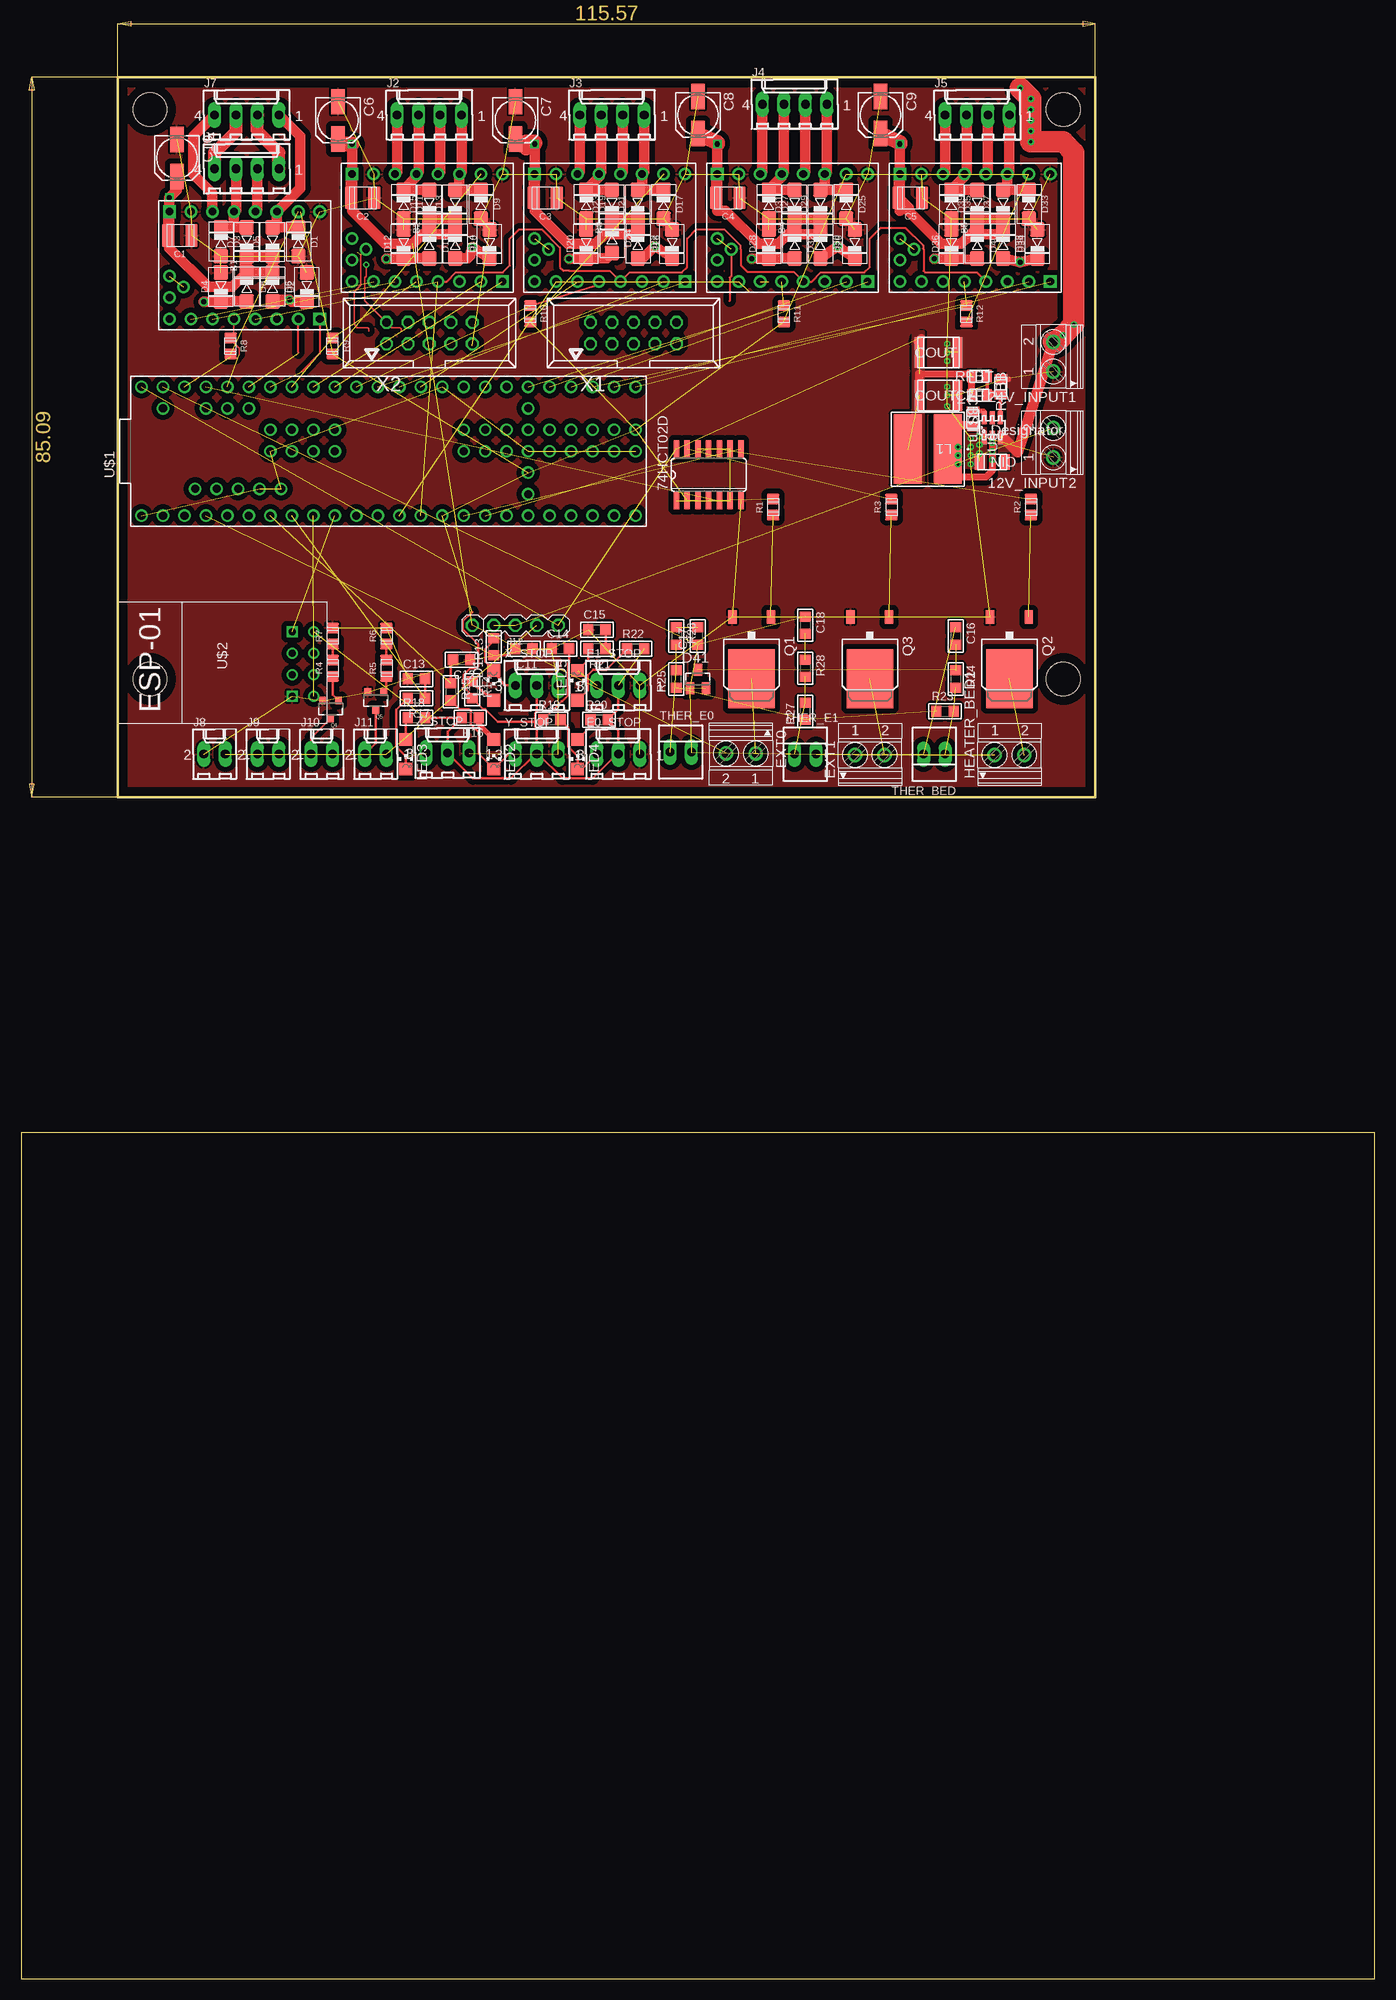
[diagram p4: board, top side]
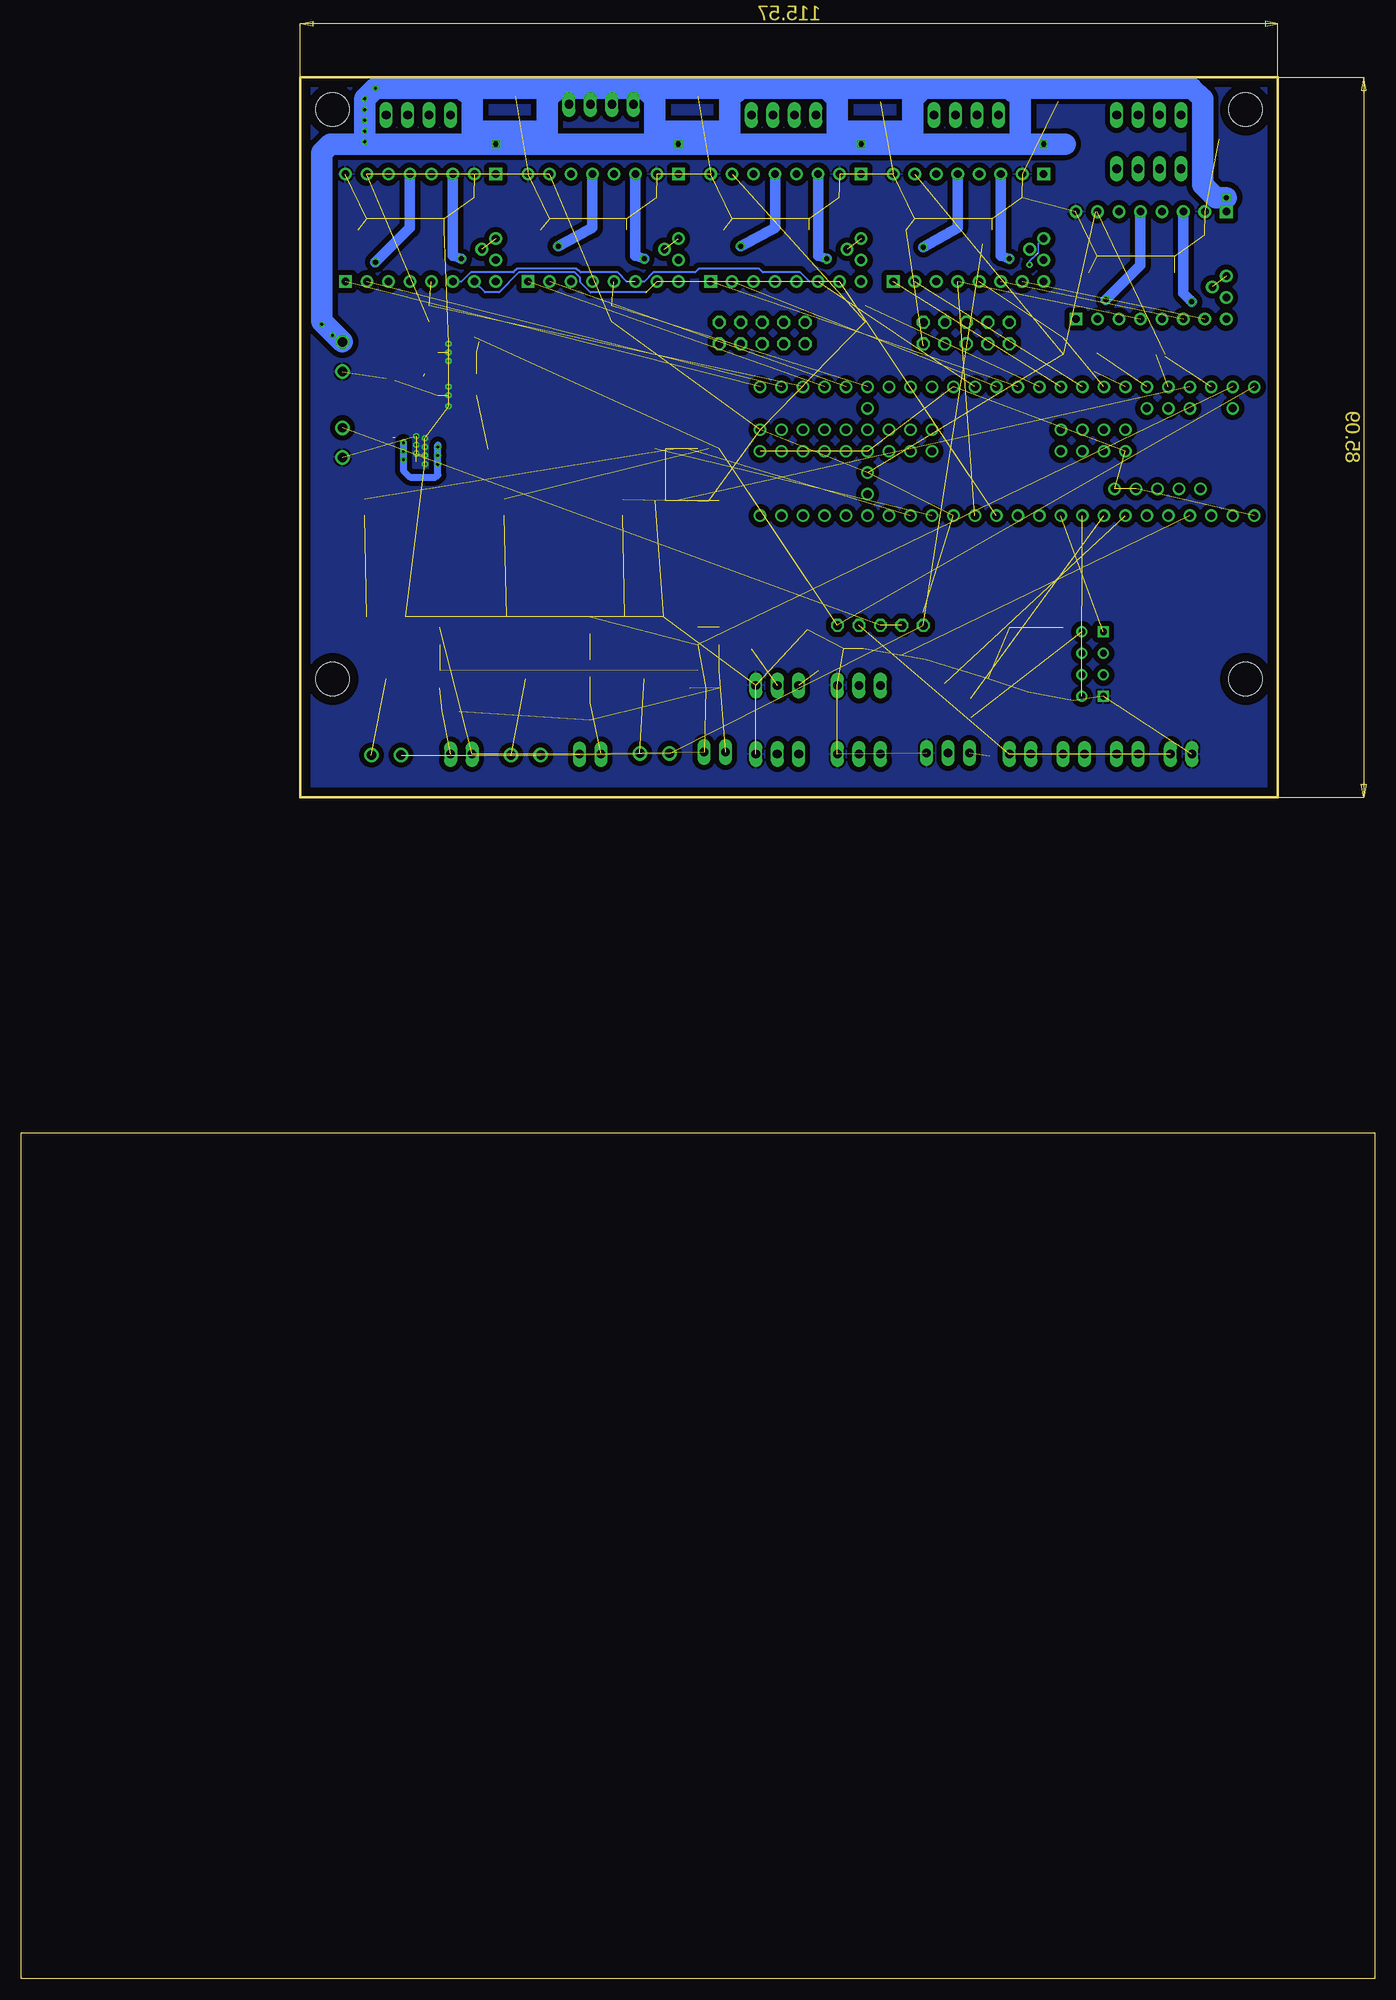
[diagram p5: board, bottom side, seen from below]

Size 160 x 224.79 mm. Coordinates in mm from the lower left corner, seen from the top.
Outline: 0,0 160,0 160,100 0,100 0,0
Outline: 11.43,224.79 127,224.79 127,139.7 11.43,139.7 11.43,224.79
Copper layers (1*16): 10 0.035mm / dielectric 1.5mm / Bottom 0.035mm
Design rules "default": minimum track width 10mil, minimum drill 24mil, track to track 8mil, track to pad 8mil, pad to pad 8mil, via to via 8mil, smd to smd 8mil, copper to edge 40mil, drill to drill 8mil, minimum pad ring 10mil, minimum via ring 8mil, stop-mask expansion 4mil, vias tented up to drill 0mil, thermal gap 10mil
Holes 4 mm at 15.24,220.98 123.19,220.98 15.24,153.67 123.19,153.67

### Footprints (pad centres in the part's own frame; a part is rotated, then mirrored left to right if it is on the bottom)
1751248 = drill 1.1 pad 1.7: 1 -1.75,-0.1; 2 1.75,-0.1
SO14 = smd 0.66 x 2.032: 1 -3.81,-3.073; 2 -2.54,-3.073; 3 -1.27,-3.073; 4 0,-3.073; 5 1.27,-3.073; 6 2.54,-3.073; 7 3.81,-3.073; 8 3.81,3.073; 9 2.54,3.073; 10 1.27,3.073; 11 0,3.073; 12 -1.27,3.073; 13 -2.54,3.073; 14 -3.81,3.073
STEPSTICK_TP = drill 0.9 pad 1.5: CFG1 -6.35,6.35; CFG2 -6.35,3.81; CFG3 -6.35,1.27; DIAG0 -2.54,7.239; DIAG1 -1.27,8.89; EN -6.35,8.89; GND@1 6.35,6.35; GND@2 6.35,-8.89; M1A 6.35,-1.27; M1B 6.35,-3.81; M2A 6.35,1.27; M2B 6.35,3.81; NC -6.35,-3.81; NC/CFG0 -6.35,-1.27; STEP -6.35,-6.35; VIO 6.35,-6.35; VREF -3.81,8.89 | drill 0.9 pad 1.5 square: DIR -6.35,-8.89; VM 6.35,8.89
C1210 = smd 2.7 x 1.45: 1 0,1.4; 2 0,-1.35
153CLV-0505 = smd 3 x 1.6: + 2.2,0; - -2.2,0
C0805 = smd 1.2 x 1.3: 1 -1.016,0; 2 1.016,0
0805 = smd 1.118 x 1.448: 1 -0.902,0; 2 0.902,0
1206_180 = smd 1.118 x 1.803: 1 -1.499,0; 2 1.499,0
1812 = smd 1.067 x 3.607: 1 -2.273,0; 2 2.273,0
SMA_DO214AC = smd 1.7 x 1.7: A 0,-1.7; C 0,1.7
SOT23 = smd 1 x 1.4: 1 -0.95,-1.1; 2 0.95,-1.1; 3 0,1.1
6410-03 = drill 1.016 long: 1 2.54,0; 2 0,0; 3 -2.54,0
6410-04 = drill 1.016 long: 1 3.81,0; 2 1.27,0; 3 -1.27,0; 4 -3.81,0
6410-02 = drill 1.016 long: 1 1.27,0; 2 -1.27,0
MA05-1 = drill 1 octagon: 1 0,5.08; 2 0,2.54; 3 0,0; 4 0,-2.54; 5 0,-5.08
VLP8040 = smd 3.302 x 8.204: 1 -2.349,0; 2 2.349,0
CHIPLED_1206 = smd 1.5 x 1.5: A 0,-1.75; C 0,1.75
D-PAK_TO252AA = smd 1 x 1.6: 1 -2.28,-4.8; 3 2.28,-4.8 | smd 5.5 x 7: 2 0,2.5
SOT23-3 = smd 0.8 x 0.9: 1 -0.95,-1; 2 0.95,-1; 3 0,1.1
C0805' = smd 1.5 x 1.25: 1 0,0.95; 2 0,-0.95
R0805 = smd 1.2 x 1.3: 1 -1.016,0; 2 1.016,0
22-23-2021 = drill 1 long: 1 -1.27,0; 2 1.27,0
DDC0006A_N = smd 1.575 x 0.559: 1 -1.168,0.95; 2 -1.168,0; 3 -1.168,-0.95; 4 1.168,-0.95; 5 1.168,0; 6 1.168,0.95
TEENSY_3.6_ALL_PINS&PADS = drill 0.965: 0 -7.62,26.67; 1 -7.62,24.13; 2 -7.62,21.59; 3 -7.62,19.05; 3.3V 7.62,24.13; 3.3V2 2.54,-29.21; 3.3V3 -7.62,-6.35; 3.3V4 -2.54,-16.51; 4 -7.62,16.51; 5 -7.62,13.97; 6 -7.62,11.43; 7 -7.62,8.89; 8 -7.62,6.35; 9 -7.62,3.81; 10 -7.62,1.27; 11 -7.62,-1.27; 12 -7.62,-3.81; 13 7.62,-3.81; 14/A0 7.62,-1.27; 15/A1 7.62,1.27; 16/A2 7.62,3.81; 17/A3 7.62,6.35; 18/A4 7.62,8.89; 19/A5 7.62,11.43; 20/A6 7.62,13.97; 21/A7 7.62,16.51; 22/A8 7.62,19.05; 23/A9 7.62,21.59; 24 -7.62,-8.89; 25 -7.62,-11.43; 26 -7.62,-13.97; 27 -7.62,-16.51; 28 -7.62,-19.05; 29 -7.62,-21.59; 30 -7.62,-24.13; 31/A12 -7.62,-26.67; 32/A13 -7.62,-29.21; 33/A14 7.62,-29.21; 34/A15 7.62,-26.67; 35/A16 7.62,-24.13; 36/A17 7.62,-21.59; 37/A18 7.62,-19.05; 38/A19 7.62,-16.51; 39/A20 7.62,-13.97; 40 0,-8.89; 41 0,-11.43; 42 0,-13.97; 43 0,-19.05; 44 0,-21.59; 45 0,-24.13; 46 0,-26.67; 47 2.54,-26.67; 48 2.54,-24.13; 49 2.54,-21.59; 50 2.54,-19.05; 51 2.54,-13.97; 52 2.54,-11.43; 53 2.54,-8.89; 54 2.54,6.35; 55 2.54,8.89; 56 2.54,11.43; 57 2.54,13.97; A10 5.08,19.05; A11 5.08,16.51; A21 7.62,-11.43; A22 7.62,-8.89; AGND 7.62,26.67; AREF 5.08,21.59; D+ -4.445,17.78; D- -4.445,20.32; DC 0,8.89; DE 0,11.43; DO 0,6.35; GND -7.62,29.21; GND1 7.62,-6.35; GND2 0,13.97; GND3 -4.445,15.24; GND4 -4.445,12.7; GND5 0,-29.21; GND6 0,-16.51; PGM 2.54,-16.51; RESET 5.08,-16.51; VBAT -5.08,-16.51; VIN 7.62,29.21; VUSB 5.08,26.67; VUSB1 -4.445,22.86
ESP01 = drill 0.8: CH_PD -1.285,-8.178; GPIO0 1.255,-5.638; GPIO2 -1.285,-5.638; RST 1.255,-8.178; TX -3.825,-8.178; VCC 3.795,-8.178 | drill 0.8 square: GND -3.825,-5.638; RX 3.795,-5.638
057-010-1 = drill 1 octagon: 1 -5.08,-1.27; 2 -5.08,1.27; 3 -2.54,-1.27; 4 -2.54,1.27; 5 0,-1.27; 6 0,1.27; 7 2.54,-1.27; 8 2.54,1.27; 9 5.08,-1.27; 10 5.08,1.27

### Placement (x,y rotation side)
12V_INPUT2  121.92,181.61 90 top
24V_INPUT1  121.92,191.77 90 top
74HCT02D  81.28,177.8 0 top
B1  26.42,202.56 90 top
B2  48.01,207.01 90 top
B3  69.6,207.01 90 top
B4  91.19,207.01 90 top
B5  112.78,207.01 90 top
C1  18.8,206.12 90 top
C2  40.39,210.57 90 top
C3  61.98,210.57 90 top
C4  83.57,210.57 90 top
C5  105.16,210.57 90 top
C6  37.47,219.71 270 top
C7  58.42,219.71 270 top
C8  80.01,220.34 270 top
C9  101.6,220.34 270 top
C10  18.41,215.26 270 top
C11  59.44,157.23 180 top
C12  52.07,155.96 180 top
C13  46.74,153.67 0 top
C14  63.75,157.23 0 top
C15  68.07,159.51 0 top
C16  110.49,158.75 270 top
C17  80.01,158.75 90 top
C18  92.71,160.02 270 top
CBST  112.52,184.4 270 top
CFF  113.28,187.2 0 top
CIN  114.81,179.32 180 top
COUT  108.46,192.28 0 top
COUT_2  108.46,187.2 0 top
D1  32.77,205.36 0 top
D2  33.78,200.03 180 top
D3  23.62,205.36 0 top
D4  23.62,200.03 180 top
D5  29.72,205.36 180 top
D6  29.72,200.03 0 top
D7  26.67,205.36 180 top
D8  26.67,200.03 0 top
D9  54.36,209.8 0 top
D10  55.37,205.11 180 top
D11  45.21,209.8 0 top
D12  45.21,205.11 180 top
D13  51.31,209.8 180 top
D14  51.31,205.11 0 top
D15  48.26,209.8 180 top
D16  48.26,205.11 0 top
D17  75.95,209.8 0 top
D18  76.96,205.11 180 top
D19  66.8,209.8 0 top
D20  66.8,205.11 180 top
D21  72.9,209.8 180 top
D22  72.9,205.11 0 top
D23  69.85,209.8 180 top
D24  69.85,205.74 0 top
D25  97.54,209.8 0 top
D26  98.55,205.11 180 top
D27  88.39,209.8 0 top
D28  88.39,205.11 180 top
D29  94.49,209.8 180 top
D30  94.49,205.11 0 top
D31  91.44,209.8 180 top
D32  91.44,205.11 0 top
D33  119.13,209.8 0 top
D34  120.14,205.11 180 top
D35  109.98,209.8 0 top
D36  109.98,205.11 180 top
D37  116.08,209.8 180 top
D38  116.08,205.11 0 top
D39  113.03,209.8 180 top
D40  113.03,205.11 0 top
D41  80.01,153.67 0 top
E0_STOP  70.61,144.78 0 top
E1_STOP  70.61,152.91 0 top
EXT0  85.09,144.78 180 top
EXT1  100.33,144.78 0 top
HEATER_BED1  116.84,144.78 0 top
J1  26.67,214 0 top
J2  48.26,220.34 0 top
J3  69.85,220.34 0 top
J4  91.44,221.62 0 top
J5  113.03,220.34 0 top
J7  26.67,220.34 0 top
J8  22.86,144.78 0 top
J9  29.21,144.78 0 top
J10  35.56,144.78 0 top
J11  41.91,144.78 0 top
J12  58.42,160.02 90 top
L1  107.19,180.85 180 top
LED1  55.88,152.91 0 top
LED2  55.88,144.78 180 top
LED3  45.47,144.78 180 top
LED4  65.79,144.78 180 top
LED5  65.79,152.91 0 top
Q1  86.36,156.21 180 top
Q2  116.84,156.21 180 top
Q3  100.33,156.21 180 top
Q4  36.58,150.11 180 top
Q5  41.91,151.13 180 top
R1  180R  [C0805']  88.9,173.99 0 top
R2  180R  [C0805']  119.38,173.99 0 top
R3  180R  [C0805']  102.87,173.99 0 top
R4  1k  [C0805']  36.83,154.94 0 top
R5  1k  [C0805']  43.18,154.94 0 top
R6  10k  [C0805']  43.18,158.75 0 top
R7  10k  [C0805']  36.83,158.75 0 top
R8  10k  [C0805']  24.76,193.04 180 top
R9  10k  [C0805']  36.83,193.04 180 top
R10  10k  [C0805']  60.2,196.85 180 top
R11  10k  [C0805']  90.17,196.85 180 top
R12  10k  [C0805']  111.76,196.85 180 top
R13  55.88,157.48 90 top
R14  53.34,152.4 270 top
R15  50.8,152.15 270 top
R16  53.09,149.1 180 top
R17  46.74,151.38 180 top
R18  46.74,149.1 0 top
R19  62.74,148.84 0 top
R20  68.33,148.84 0 top
R21  68.07,157.23 180 top
R22  72.64,157.23 0 top
R23  109.22,149.86 0 top
R24  110.49,153.67 270 top
R25  77.47,153.67 90 top
R26  77.47,158.75 270 top
R27  92.71,149.86 90 top
R28  92.71,154.94 270 top
RFBB  115.82,188.21 90 top
RFBT  113.28,189.48 0 top
THER_BED  107.95,144.78 180 top
THER_E0  77.98,145.03 0 top
THER_E1  92.71,144.78 0 top
U6  114.81,183.39 90 top
U$1  43.43,180.59 90 top
U$2  26.42,155.45 90 top
X1  72.39,194.56 0 top
X2  48.26,194.56 0 top
X_STOP  60.96,152.91 0 top
Y_STOP  60.96,144.78 0 top
Z_STOP  50.42,144.91 0 top

### Tracks (layer width: path | path; a pad name or v marks a point on that pad's centre or on a via)
1
  10 0.61: U6.6 113.86,185.31 CBST.1
2
  10 0.406: U6.4 115.76,187.31 | RFBT.2 CFF.2
  10 0.813: CFF.2 114.19,187.31 RFBB.1 115.76,187.31
3  (via drill 0.33)
  10 0.813: 109.73,181.04 109.73,178.94 111.12,177.55 114.05,177.55 114.81,178.31 v114.81,179.58 v114.81,180.59 v114.81,181.61 U6.2 | 109.73,181.04 109.73,182.12 110.6,182.99 | 109.73,181.04 L1.1
  10 1.016: CBST.2 112.52,183.64 109.54,183.64 L1.1
  Bottom 0.813: v114.81,181.61 114.81,178.31 114.05,177.55 111,177.55 110.74,177.8 v110.74,179.07 v110.74,180.09 v110.74,181.1 110.74,181.36
3V3  (18 unrouted)
  10 0.305: R18.2 R16.2 50.42,147.45 Z_STOP.2 53.4,141.92 57.91,141.92 60.76,144.78 Y_STOP.2 | Y_STOP.2 60.96,147.85 60.77,148.05 60.77,148.59 | 60.77,148.59 60.77,149.64 60.96,149.84 X_STOP.2 | E1_STOP.2 70.61,150.11 R20.2 70.61,147.57 E0_STOP.2 70.42,144.78 67.56,141.92 64.01,141.92 61.16,144.78 Y_STOP.2 | 60.77,148.59 56.36,148.59 54.85,150.1 54.62,150.1 R14.2 53.34,151.66 52.33,152.67 52.33,154.16 53.12,154.95 53.83,154.95 54.04,155.16 54.04,157.75 52.23,159.56 52.23,160.48 53.34,161.59
  10 0.61: 24.76,191.77 R8.1
  10 0.813: 24.76,191.9 R8.1
  Bottom 0.61: B1.VIO 33.02,208.92
5V  (7 unrouted)
  10 0.813: 106.43,194.06 105.92,193.55 | 106.19,189.74 112.27,189.74 | CFF.1 RFBT.1
  10 1.016: COUT_2.1 106.19,189.74
  pour 10 (no thermals): 106.68,176.78 103.38,176.78 103.38,184.91 105.41,184.91 105.41,194.82 106.68,194.82
12V  (2 unrouted)
A_REF  (3 unrouted)
AGND  (7 unrouted)
BED  (1 unrouted)
BED-  (1 unrouted)
CS_S1  (1 unrouted)
  10 0.152: 25.79,192.01 25.79,192.76 24.76,193.79 R8.2 25.15,194.37 B1.CFG3
CS_S2  (2 unrouted)
CS_S3  (1 unrouted)
  10 0.254: R10.2 68.58,200.41 B3.CFG3
CS_S4  (2 unrouted)
CS_S5  (2 unrouted)
DIAG_S1  (1 unrouted)
DIAG_S2  (via drill 0.33)  (1 unrouted)
  10 0.152: B2.DIAG0 40.15,203.85 40.15,200.23 39.37,199.46 39.37,195.58 39.74,195.21 40.96,195.21 41.12,195.05 41.12,194.8 | v40.79,202.63 40.79,201.25 40.63,201.09 40.63,198.4 43.82,195.21 44.77,195.21 44.93,195.05 44.93,194.8
  Bottom 0.152: B2.DIAG1 39.74,205.12 39.74,204.04 40.34,203.44 40.4,203.44 40.79,203.05 v40.79,202.63
DIAG_S3  (1 unrouted)
DIAG_S4  (1 unrouted)
  10 0.254: B4.DIAG0 83.95,201.3 83.76,201.11 83.76,198.36
DIAG_S5  (1 unrouted)
DIR_S1  (1 unrouted)
  10 0.254: B1.DIR 35.31,192.15 33.15,189.99
DIR_S2  (1 unrouted)
DIR_S3  (1 unrouted)
DIR_S4  (1 unrouted)
DIR_S5  (1 unrouted)
E0-  (1 unrouted)
E0_STOP
  10 0.305: R19.1 63.91,151.03 63.96,151.03 64.68,151.75 64.68,155.56 64.77,155.65 C14.2
E0_STOP_PORT
  10 0.305: 63.75,148.56 R19.2 64.68,147.92 64.68,145.63 65.79,144.53 LED4.C 66.32,143.03 E0_STOP.3
E1-  (1 unrouted)
E1_STOP
  10 0.305: R21.1 C15.2
E1_STOP_PORT  (1 unrouted)
  10 0.305: LED5.C 67.06,155.93 R21.2
EX0  (1 unrouted)
EX1  (1 unrouted)
FAN0
  10 0.305: R4.1 R7.2
FAN0-
  10 0.305: Q4.3 34.29,146.73 J10.2
FAN1
  10 0.305: R5.1 R6.2
FAN1-
  10 0.305: Q5.3 41.91,146.05 J11.2
GND  (via drill 0.33, 0.33 pad 0.33, 0.35)  (80 unrouted)
  10 0.406: RFBB.2 115.82,188.98 116.84,188.98 116.84,189.23
  other vias: 112.27,179.07 112.27,180.09 112.27,181.1 112.27,182.12 113.28,180.34 113.28,181.36 113.28,182.37 109.47,185.93 109.47,187.2 109.47,188.21 109.47,191.26 109.47,192.28 109.47,193.29 53.34,193.04
  pour 10 (no thermals): 114.05,183.39 114.05,178.56 111.76,178.56 111.76,183.9 113.28,183.9 113.28,183.39
  pour Bottom (isolate 0.61, no thermals): 117.35,176.78 103.38,176.78 103.38,184.91 105.41,184.91 105.41,194.82 117.35,194.82
  pour 10 (no thermals): 107.19,194.82 107.19,190.5 116.59,190.5 116.59,183.39 117.35,183.39 117.35,194.82
  pour 10 (no thermals): 111,188.72 111,185.42 107.19,185.42 107.19,188.72
  pour 10 (isolate 0.61): 11.43,224.79 127,224.79 127,139.7 11.43,139.7
  pour Bottom (isolate 0.61): 11.43,224.79 127,224.79 127,139.7 11.43,139.7
MC1A_S1  (via drill 0.6 pad 0.33)
  10 1.27: D6.A 29.89,198.5 v31.75,198.5 32,198.25 33.78,198.25 D2.C | J1.2 27.94,209.17 B1.M1A
  Bottom 1.27: B1.M1A 27.69,202.56 v31.75,198.5
MC1A_S2  (via drill 0.6 pad 0.33)
  10 1.27: J2.2 49.53,213.61 B2.M1A | D14.A 52.78,203.41 53.09,203.71 v53.34,204.72 55.32,203.45 D10.C
  Bottom 1.27: B2.M1A 49.28,207.01 v53.34,204.72
MC1A_S3  (via drill 0.6 pad 0.33)
  10 1.27: J3.2 71.12,213.61 B3.M1A | D18.C 76.79,203.58 v74.93,204.85 73.48,203.41 D22.A
  Bottom 1.27: B3.M1A 70.87,207.01 v74.93,204.85
MC1A_S4  (via drill 0.6 pad 0.33)
  10 1.27: J4.2 92.71,213.61 B4.M1A | D30.A v96.52,204.85 D26.C
  Bottom 1.27: B4.M1A 92.46,207.01 v96.52,204.85
MC1A_S5  (via drill 0.6 pad 0.33)
  10 1.27: J5.2 114.3,213.61 B5.M1A | D38.A v118.11,202.95 D34.C
  Bottom 1.27: B5.M1A 114.05,207.01 v118.11,202.95
MC1B_S1
  10 1.27: 30.48,207.06 D5.A | 30.48,207.06 D1.C | 30.48,209.17 B1.M1B | B1.M1B 30.23,207.31 30.48,207.06 | B1.M1B 33.02,211.71 33.02,217.81 J7.1
MC1B_S2
  10 1.27: D9.C D13.A 51.82,212.01 B2.M1B 52.07,213.61 J2.1
MC1B_S3
  10 1.27: D17.C D21.A 73.41,212.01 B3.M1B 73.66,213.61 J3.1
MC1B_S4
  10 1.27: D25.C D29.A 95,212.01 B4.M1B 95.25,213.61 J4.1
MC1B_S5
  10 1.27: D33.C D37.A 116.59,212.01 B5.M1B 116.84,213.61 J5.1
MC2A_S1
  10 1.27: 25.4,207.06 D3.C | 25.4,207.06 D7.A | 25.4,207.06 25.15,207.31 B1.M2A 25.4,209.17 J1.3
MC2A_S2
  10 1.27: D15.A D11.C 46.74,213.03 B2.M2A 46.99,213.61 J2.3
MC2A_S3
  10 1.27: D23.A D19.C 68.33,213.03 B3.M2A 68.58,213.61 J3.3
MC2A_S4
  10 1.27: D31.A D27.C 89.92,213.03 B4.M2A 90.17,213.61 J4.3
MC2A_S5
  10 1.27: D39.A D35.C 111.51,213.03 B5.M2A 111.76,213.61 J5.3
MC2B_S1  (via drill 0.6 pad 0.33)
  10 1.27: v21.59,198.25 23.54,198.25 D4.C D8.A | B1.M2B 22.61,211.07 20.32,213.36 20.32,217.81 J7.4
  Bottom 1.27: B1.M2B 22.61,199.26 v21.59,198.25
MC2B_S2  (via drill 0.6 pad 0.33)
  10 1.27: J2.4 44.45,213.61 B2.M2B | v43.18,203.33 45.13,203.33 D12.C D16.A
  Bottom 1.27: B2.M2B 44.2,203.71 v43.18,203.33
MC2B_S3  (via drill 0.6 pad 0.33)
  10 1.27: J3.4 66.04,213.61 B3.M2B | v64.77,203.33 66.72,203.33 D20.C 69.22,203.41 D24.A
  Bottom 1.27: B3.M2B 65.79,203.71 v64.77,203.33
MC2B_S4  (via drill 0.6 pad 0.33)
  10 1.27: J4.4 87.63,213.61 B4.M2B | v86.36,203.33 D28.C D32.A
  Bottom 1.27: B4.M2B 87.38,203.71 v86.36,203.33
MC2B_S5  (via drill 0.6 pad 0.33)
  10 1.27: J5.4 109.22,213.61 B5.M2B | v107.95,203.33 D36.C 113.03,203.2 D40.A
  Bottom 1.27: B5.M2B 108.97,203.71 v107.95,203.33
N$1  (1 unrouted)
N$2  (1 unrouted)
N$3  (1 unrouted)
N$4  (1 unrouted)
N$5  (1 unrouted)
N$6  (1 unrouted)
N$8  (3 unrouted)
N$9
  10 0.305: R4.2 36.83,151.81 Q4.1
N$10
  10 0.305: LED1.A 53.34,153.19 R14.1
N$11
  10 1.524: J1.4 22.86,215.9 25.4,218.44 J7.3
N$12
  10 1.524: J1.1 30.48,215.9 27.94,218.44 J7.2
N$13
  10 0.61: LED2.A 54.1,148.31 R16.1
N$14
  10 0.305: LED3.A 45.47,148.84 R18.1
N$17
  10 0.305: LED4.A 67.31,148.05 R20.1
N$18
  10 0.305: LED5.A 66.95,152.33 66.95,154.13 67.61,154.79 69.19,154.79 R22.1
N$19  (2 unrouted)
N$20  (2 unrouted)
N$22  (2 unrouted)
N$80  (6 unrouted)
N$89
  10 0.305: R5.2 43.18,152.45 Q5.1
RX_ESP  (1 unrouted)
SCK  (3 unrouted)
  Bottom 0.254: B4.CFG2 86.36,200.66 85.28,201.74 80.34,201.74 79.88,202.2 72.77,202.2 72.31,201.74 67.88,201.74 66.8,200.66 | B5.CFG2 107.95,200.66 106.87,201.74 101.8,201.74 101.34,202.2 94.36,202.2 93.9,201.74 89.47,201.74 88.39,200.66
SCK_BUF  (1 unrouted)
SDI  (3 unrouted)
  Bottom 0.254: B5.CFG1 105.16,199.39 103.5,199.39 101.16,201.74 94.55,201.74 93.92,201.11 93.92,200.59 92.71,199.39 86.11,199.39
SDI_BUF  (1 unrouted)
SDO  (2 unrouted)
  10 0.254: 49.53,200.66 B2.NC/CFG0 50.29,200.66 51.37,201.74 56.96,201.74 57.79,202.56 57.79,205.74 58.87,206.82 61.53,206.82 63.69,204.66 63.69,202.37 64.14,201.93 64.17,201.96 64.77,201.96 64.77,201.93 69.6,201.93 B3.NC/CFG0 71.95,201.74 78.11,201.74 78.74,202.38 78.74,205.74 79.82,206.82 83.12,206.82 85.03,204.92 85.03,204.53 85.09,204.47 85.09,202.56 85.85,201.8 91.31,201.8 B4.NC/CFG0 93.47,200.66 94.55,201.74 99.7,201.74 100.33,202.38 100.33,205.74 101.6,207.01 104.53,207.01 106.62,204.92 106.62,204.53 106.68,204.47 106.68,201.93 106.87,201.74 112.97,201.74 B5.NC/CFG0
STEP_S1  (1 unrouted)
  10 0.152: B1.STEP 32.77,192.15
  10 0.254: 32.77,192.28 B1.STEP
STEP_S2  (1 unrouted)
STEP_S3  (1 unrouted)
STEP_S4  (1 unrouted)
STEP_S5  (1 unrouted)
THER_BED  (2 unrouted)
THER_E0  (1 unrouted)
THER_E1  (1 unrouted)
TX_ESP  (1 unrouted)
V_FAN  (4 unrouted)
VIN  (via drill 0.35, 0.6)  (5 unrouted)
  10 1.016: D7.C D5.C | D15.C D13.C | D23.C D21.C | D31.C D29.C | D39.C D37.C
  10 1.27: C1.1 17.4,209.05 B1.VM | B1.VM 17.53,204.6 22.1,200.03 24.97,200.03 D8.C 26.67,201.8 | 26.67,201.8 D7.C | 26.92,201.8 26.42,202.31 26.42,203.33 26.75,203.66 D5.C 29.72,201.8 | 26.67,201.8 D6.C 29.72,201.8 | 29.72,201.8 26.42,201.8 | C2.1 38.99,213.49 B2.VM | B2.VM 39.12,209.04 43.04,205.12 46.31,205.12 47.44,206.25 48.26,206.25 | 48.26,206.25 D16.C D15.C | 48.51,206.25 48.01,206.76 48.01,207.77 48.34,208.1 D13.C D14.C 51.31,206.25 48.26,206.25 | C3.1 60.58,213.49 B3.VM | B3.VM 60.71,209.04 64.63,205.12 67.9,205.12 69.06,206.27 69.98,206.27 69.85,206.25 D24.C D23.C | 70.1,206.25 69.6,206.76 69.6,207.77 69.93,208.1 D21.C D22.C 72.9,206.25 69.6,206.25 | C4.1 82.17,213.49 B4.VM | B4.VM 82.3,209.04 83.27,209.04 87.19,205.12 89.49,205.12 90.62,206.25 94.49,206.25 D30.C D29.C 91.52,208.1 91.19,207.77 91.19,206.76 91.69,206.25 | 91.44,206.25 D32.C D31.C | B5.VM 103.76,213.49 C5.1 104.94,209.38 104.94,208.95 108.78,205.12 111.08,205.12 111.7,205.74 111.76,205.74 112.78,206.76 | B5.VM 103.89,209.04 | 113.03,206.25 D40.C D39.C | 112.78,206.76 112.78,207.77 113.11,208.1 D37.C D38.C 116.08,206.25 112.78,206.25 | 112.78,206.76 113.28,206.25 | v103.89,216.92 B5.VM | v82.3,216.92 B4.VM | v60.71,216.92 B3.VM | B2.VM v39.12,216.92 | B1.VM v17.53,210.57 18.41,211.45 C10.+ | 116.05,182.22 117.21,181.06 117.83,180.45 24V_INPUT1.2
  10 1.778: C7.+ 59.69,216.46 59.69,217.17 60.71,217.17 v60.71,216.92 | C8.+ 82.3,217.09 v82.3,216.92 | C9.+ 103.89,217.09 v103.89,216.92 | v39.12,216.92 37.47,216.92 C6.+
  10 2.54: 24V_INPUT1.2 122.4,193.52 v123.19,194.31 v124.46,195.58 124.46,215.9 123.19,217.17 v119.38,217.17 v119.38,218.44 v119.38,219.71 v119.38,220.98 v119.38,222.25 v118.11,223.52
  Bottom 2.54: 119.38,216.92 v103.89,216.92 v82.3,216.92 v60.71,216.92 v39.12,216.92 36.58,216.92 | 119.38,216.92 123.44,216.92 124.46,215.9 124.46,195.96 24V_INPUT1.2 | 96.52,223.52 97.79,222.25 97.79,218.44 106.68,218.44 106.68,222.25 107.95,223.52 | 86.36,223.52 96.52,223.52 | 86.36,223.52 85.09,222.25 85.09,218.44 76.2,218.44 76.2,222.25 74.93,223.52 | 64.77,223.52 74.93,223.52 | 64.77,223.52 63.5,222.25 63.5,218.44 54.61,218.44 54.61,222.25 53.34,223.52 | 43.18,223.52 53.34,223.52 | 43.18,223.52 41.91,222.25 41.91,218.44 | 119.38,216.92 v119.38,217.17 v119.38,218.44 v119.38,219.71 v119.38,220.98 v119.38,222.25 v118.11,223.52 107.95,223.52 | v17.53,210.57 18.8,210.57 20.32,212.09 20.32,222.25 21.59,223.52 43.18,223.52 | 53.34,223.52 64.77,223.52 | 74.93,223.52 86.36,223.52 | 96.52,223.52 107.95,223.52
  pour 10 (no thermals): 115.57,182.88 115.57,177.55 114.81,176.78 117.35,176.78 117.35,182.88
X_STOP  (1 unrouted)
  10 0.305: R13.1 57.66,156.46 C11.2
X_STOP_PORT
  10 0.305: X_STOP.3 57.12,152.91 LED1.C 55.88,154.71 54.87,155.72 54.87,157.21 55.88,158.22 R13.2
Y_STOP  (1 unrouted)
  10 0.305: R15.1 50.8,155.7 C12.2
Y_STOP_PORT
  10 0.305: R15.2 51.83,150.1 52.94,150.1 53.15,149.9 53.15,148.3 54.08,147.37 54.08,144.83 LED2.C 57.63,144.78 Y_STOP.3
Z_STOP  (1 unrouted)
  10 0.305: R17.1 C13.2
Z_STOP_PORT  (1 unrouted)
  10 0.305: LED3.C 45.47,144.53 44.36,145.63 44.36,150.02 R17.2